# Altium project J_Tag.PrjPCB
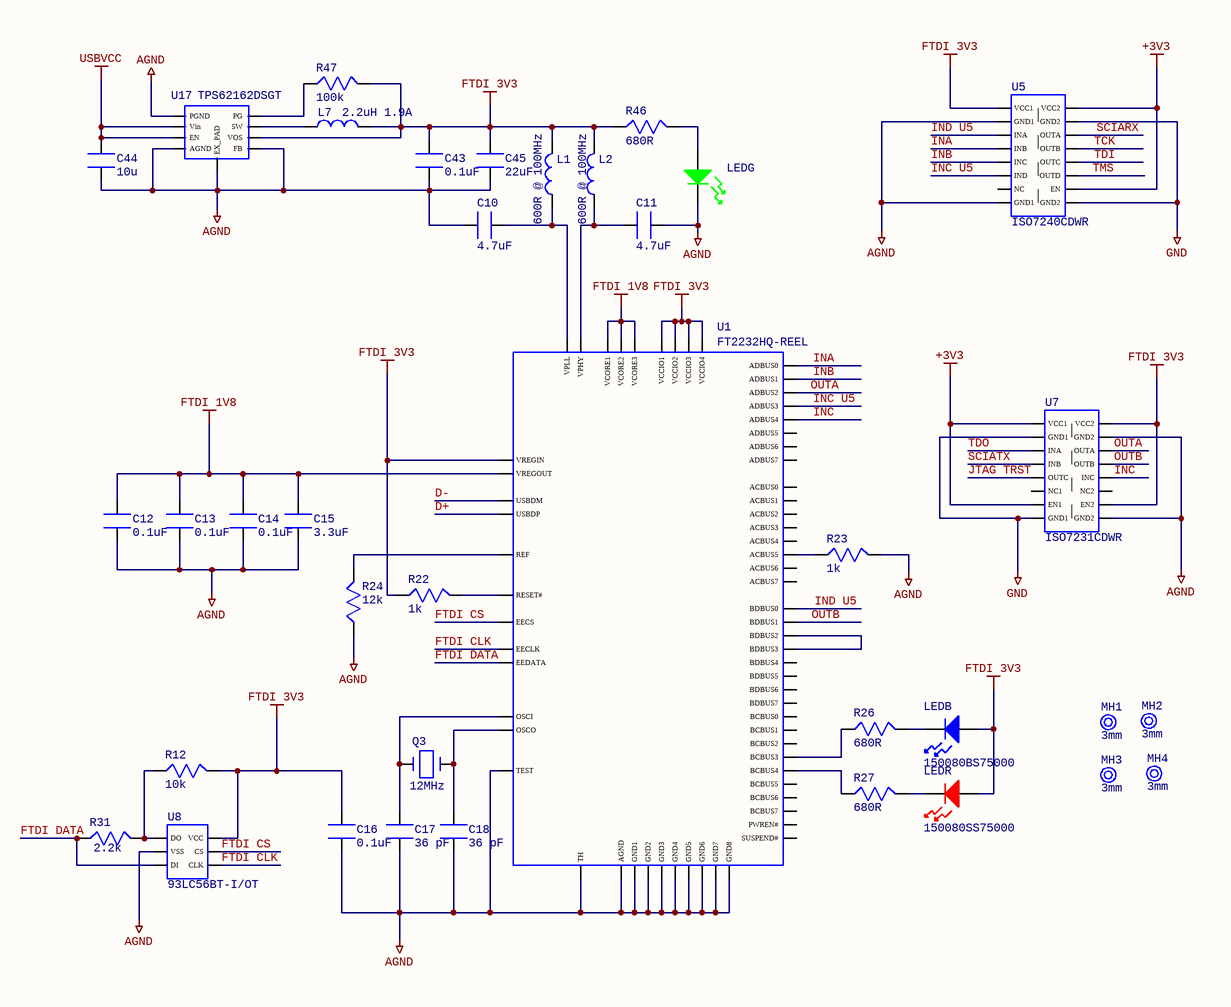
[diagram p0: J_TAG_SCH.SchDoc]
2 sheets, 46 parts. Net scope: global (net labels, ports and power ports of the same name join across sheets).
Board file: J_TAG_PCB.PcbDoc
Sheets:
  J_TAG_SCH.SchDoc
  Konektori_SCH.SchDoc

## Sheet J_TAG_SCH.SchDoc
size A3

### Parts
C10  4.7uF  [GRM155R60J475ME47D]
C11  4.7uF  [GRM155R60J475ME47D]
C12  0.1uF  [GRM155R61A104KA01D]
C13  0.1uF  [GRM155R61A104KA01D]
C14  0.1uF  [GRM155R61A104KA01D]
C15  3.3uF  [C1608X5R1C335K080AC]
C16  0.1uF  [GRM155R61A104KA01D]
C17  36 pF  [GRM1555C1H360JA01D]
C18  36 pF  [GRM1555C1H360JA01D]
C43  0.1uF  [GRM155R61A104KA01D]
C44  10u  [GRM32DR71E106KA12L]
C45  22uF  [GRM32ER61E226KE15L]
L1  600R @ 100MHz  [BLM15AG601SN1D]
L2  600R @ 100MHz  [BLM15AG601SN1D]
L7  2.2uH 1.9A  [CDRH2D18/HPNP-2R2NC]
LEDB  150080BS75000  [150080BS75000]
LEDG  (no value)  [150080VS75000]
LEDR  150080SS75000  [150080SS75000]
MH1  3mm  [MH_3MM]
MH2  3mm  [MH_3MM]
MH3  3mm  [MH_3MM]
MH4  3mm  [MH_3MM]
Q3  12MHz  [ABLS2-12.000MHZ-D4Y-T]
R12  10k  [RC0402FR-0710KL]
R22  1k  [RC0402FR-071KL]
R23  1k  [RC0402FR-071KL]
R24  12k  [RC0402FR-0712KL]
R26  680R  [RC0402FR-07680RL]
R27  680R  [RC0402FR-07680RL]
R31  2.2k  [CRCW04022K20FKEDC]
R46  680R  [RC0402FR-07680RL]
R47  100k  [RC0402FR-07100KL]
U1  FT2232HQ-REEL  [FT2232HQ-REEL]
U5  ISO7240CDWR  [ISO7240CDWR]
U7  ISO7231CDWR  [ISO7231CDWR]
U8  93LC56BT-I/OT  [93LC56BT-I/OT]
U17  TPS62162DSGT  [TPS62162DSGT]

### Nets
+3V3: U5.EN U5.VCC2 U7.EN1 U7.VCC1
AGND: C10.1 C11.2 C12.1 C13.1 C14.1 C15.1 C16.1 C17.1 C18.1 C43.1 C44.1 C45.1 LEDG.K R23.2 R24.1 U1.AGND U1.GND1 U1.GND2 U1.GND3 U1.GND4 U1.GND5 U1.GND6 U1.GND7 U1.GND8 U1.TEST U1.TH U5.GND1 U7.GND2 U8.VSS U17.AGND U17.EX_PAD U17.FB U17.PGND
FTDI 1V8: C12.2 C13.2 C14.2 C15.2 U1.VCORE1 U1.VCORE2 U1.VCORE3 U1.VREGOUT
FTDI 3V3: C16.2 C43.2 C45.2 L1.1 L2.1 L7.1 LEDB.A LEDR.A R12.2 R22.1 R46.1 R47.2 U1.VCCIO1 U1.VCCIO2 U1.VCCIO3 U1.VCCIO4 U1.VREGIN U5.VCC1 U7.EN2 U7.VCC2 U8.VCC U17.VOS
GND: U5.GND2 U7.GND1
USBVCC: C44.2 U17.EN U17.Vin
D+: U1.USBDP
D-: U1.USBDM
FTDI CLK: U1.EECLK U8.CLK
FTDI CS: U1.EECS U8.CS
FTDI DATA: R31.1 U1.EEDATA U8.DI
INA: U1.ADBUS0 U5.INB
INB: U1.ADBUS1 U5.INC
INC: U1.ADBUS4 U7.INC
INC U5: U1.ADBUS3 U5.IND
IND U5: U1.BDBUS0 U5.INA
JTAG TRST: U7.OUTC
OUTA: U1.ADBUS2 U7.OUTA
OUTB: U1.BDBUS1 U7.OUTB
SCIARX: U5.OUTA
SCIATX: U7.INB
TCK: U5.OUTB
TDI: U5.OUTC
TDO: U7.INA
TMS: U5.OUTD
NetC10_2: C10.2 L1.2 U1.VPLL
NetC11_1: C11.1 L2.2 U1.VPHY
NetC17_2: C17.2 Q3.1 U1.OSCI
NetC18_2: C18.2 Q3.2 U1.OSCO
NetL7_2: L7.2 U17.SW
NetLEDB_K: LEDB.K R26.2
NetLEDG_A: LEDG.A R46.2
NetLEDR_K: LEDR.K R27.2
NetR12_1: R12.1 R31.2 U8.DO
NetR22_2: R22.2 U1.RESET#
NetR23_1: R23.1 U1.ACBUS5
NetR24_2: R24.2 U1.REF
NetR26_1: R26.1 U1.BCBUS3
NetR27_1: R27.1 U1.BCBUS4
NetR47_1: R47.1 U17.PG
NetU1_BDBUS2: U1.BDBUS2 U1.BDBUS3

Not connected (* = marked no-connect by the designer): U1 ACBUS0 ACBUS1 ACBUS2 ACBUS3 ACBUS4 ACBUS6 ACBUS7 ADBUS5 ADBUS6 ADBUS7 BCBUS0 BCBUS1 BCBUS2 BCBUS5 BCBUS6 BCBUS7 BDBUS4 BDBUS5 BDBUS6 BDBUS7 PWREN# SUSPEND#; U5 NC; U7 NC1 NC2

### Library data of the parts
C10 C11 = GRM155R60J475ME47D: C10, C11; Supplier 1: Digi-Key; Supplier Part Number 1: 490-5915-1-ND
C12-C14 C16 C43 = GRM155R61A104KA01D: C12, C13, C14, C16, C43; Supplier 1: Digi-Key; Supplier Part Number 1: 490-1318-6-ND
C15 = C1608X5R1C335K080AC: C15; Supplier 1: Digi-Key; Supplier Part Number 1: 445-7476-6-ND
C17 C18 = GRM1555C1H360JA01D: C17, C18; Supplier 1: Digi-Key; Supplier Part Number 1: 490-6044-6-ND
C44 = GRM32DR71E106KA12L: C41, C44, 10u; Supplier 1: Digi-Key; Supplier Part Number 1: 490-1867-6-ND
C45 = GRM32ER61E226KE15L: C45; Supplier 1: Digi-Key; Supplier Part Number 1: 490-3889-6-ND
L1 L2 = BLM15AG601SN1D: L1, L2; Supplier 1: Digi-Key; Supplier Part Number 1: 490-1006-6-ND
L7 = CDRH2D18/HPNP-2R2NC: L7; Supplier 1: Digi-Key; Supplier Part Number 1: 308-2295-6-ND
LEDB = 150080BS75000onent_1: BLUE LED; Supplier 1: Digi-Key; Supplier Part Number 1: 732-4982-6-ND
LEDG = 150080VS75000: GREEN LED; Supplier 1: Digi-Key; Supplier Part Number 1: 732-4986-6-ND
LEDR = 150080SS75000: RED LED; Supplier 1: Digi-Key; Supplier Part Number 1: 732-4985-6-ND
MH1-MH4 = TH_3MM: odsojnik
Q3 = ABLS2-12.000MHZ-D4Y-T: Oscilator 12MHz; Supplier 1: Digi-Key; Supplier Part Number 1: 535-9869-6-ND
R12 = RC0402FR-0710KL: R12, 10K; Supplier 1: Digi-Key; Supplier Part Number 1: 311-10.0KLRDKR-ND
R22 R23 = RC0402FR-071KL: R22, R23, 1K; Supplier 1: Digi-Key; Supplier Part Number 1: 311-1.00KLRDKR-ND
R24 = RC0402FR-0712KL: Supplier 1: Digi-Key; Supplier Part Number 1: 311-12.0KLRDKR-ND
R26 R27 R46 = RC0402FR-07680RL: R26, R27, R46, RC0402FR-07680RL; Supplier 1: Digi-Key; Supplier Part Number 1: 311-680LRDKR-ND
R31 = CRCW04022K20FKEDC: R31; Supplier 1: Digi-Key; Supplier Part Number 1: 541-3971-6-ND
R47 = RC0402FR-07100KL: Supplier 1: Digi-Key; Supplier Part Number 1: 311-100KLRDKR-ND
U1 = FT2232HQ-REEL: IC kontroler; Supplier 1: Digi-Key; Supplier Part Number 1: 768-1025-6-ND
U5 = ISO7240CDWR: Izolator; Supplier 1: Digi-Key; Supplier Part Number 1: 296-38555-6-ND
U7 = ISO7231CDWR: Izolator; Supplier 1: Digi-Key; Supplier Part Number 1: 296-38966-6-ND
U8 = 93LC56BT-I/OT: IC memorija; Supplier 1: Digi-Key; Supplier Part Number 1: 93LC56BT-I/OTDKR-ND
U17 = TPS62162DSGT: DC-DC Buck; Supplier 1: Digi-Key; Supplier Part Number 1: 296-29897-1-ND

## Sheet Konektori_SCH.SchDoc: J_Tag_Programator
size A; CheckedBy: Lazar Nikolovski; Author: Lazar Nikolovski; CompanyName: Herran Innovation Ltd.; DrawnBy: Lazar Nikolovski; Engineer: Lazar Nikolovski; DocumentNumber: 2
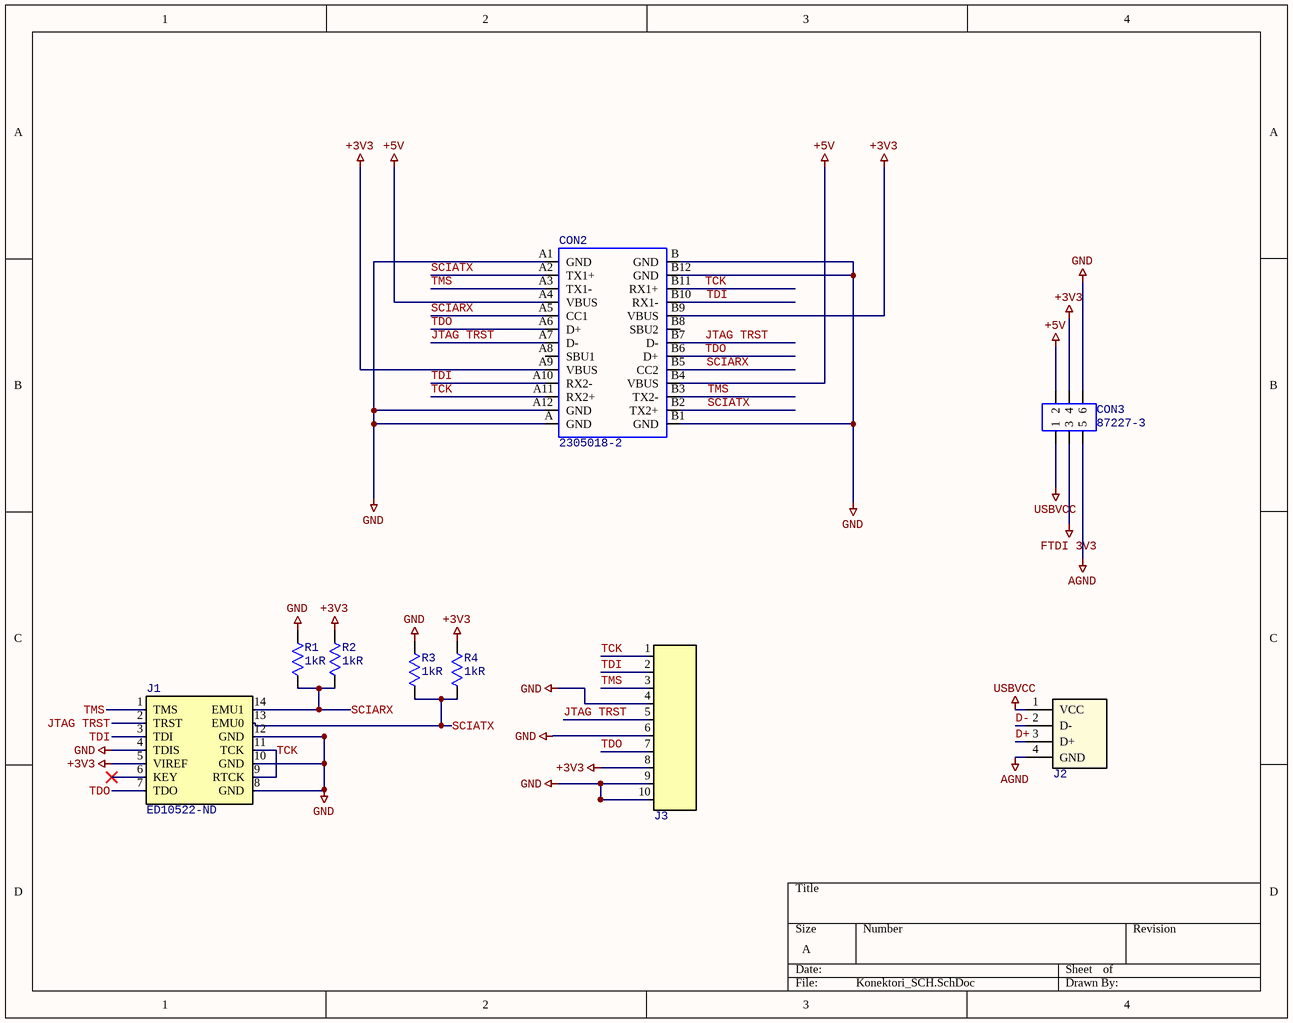
[diagram p1: Konektori_SCH.SchDoc]

### Parts
CON2  2305018-2  [2305018-2]
CON3  87227-3  [87227-3]
J1  ED10522-ND  [14_DIP_JTAG]
J2  USB-B1HSB6  [CON_RCPT_USB-B1HSB6]  (value not drawn)
J3  8-215079-0  [CON_BTB_F_8-215079-0]  (value not drawn)
R1  Resistance: 1kR  [SMD_0603_RES]  (hidden comment: RC0603FR-071KL)
R2  Resistance: 1kR  [SMD_0603_RES]  (hidden comment: RC0603FR-071KL)
R3  Resistance: 1kR  [SMD_0603_RES]  (hidden comment: RC0603FR-071KL)
R4  Resistance: 1kR  [SMD_0603_RES]  (hidden comment: RC0603FR-071KL)

### Nets
+3V3: CON2.A9(VBUS) CON2.B9(VBUS) CON3.4 J1.5(VIREF) J3.8 R2.2 R4.2
+5V: CON2.A4(VBUS) CON2.B4(VBUS) CON3.2
AGND: CON3.5 J2.4(GND)
FTDI 3V3: CON3.3
GND: CON2.A(GND) CON2.A1(GND) CON2.A12(GND) CON2.B(GND) CON2.B1(GND) CON2.B12(GND) CON3.6 J1.4(TDIS) J1.8(GND) J1.10(GND) J1.12(GND) J3.4 J3.6 J3.9 J3.10 R1.2 R3.2
USBVCC: CON3.1 J2.1(VCC)
D+: J2.3(D+)
D-: J2.2(D-)
JTAG TRST: CON2.A7(D-) CON2.B7(D-) J1.2(TRST) J3.5
SCIARX: CON2.A5(CC1) CON2.B5(CC2) J1.14(EMU1) R1.1 R2.1
SCIATX: CON2.A2(TX1+) CON2.B2(TX2+) J1.13(EMU0) R3.1 R4.1
TCK: CON2.A11(RX2+) CON2.B11(RX1+) J1.9(RTCK) J1.11(TCK) J3.1
TDI: CON2.A10(RX2-) CON2.B10(RX1-) J1.3(TDI) J3.2
TDO: CON2.A6(D+) CON2.B6(D+) J1.7(TDO) J3.7
TMS: CON2.A3(TX1-) CON2.B3(TX2-) J1.1(TMS) J3.3

Not connected (* = marked no-connect by the designer): CON2 A8(SBU1) B8(SBU2); J1 6(KEY)*

### Library data of the parts
CON2 = 2305018-2: USB C konektor; Supplier 1: Digi-Key; Supplier Part Number 1: A132569DKR-ND
CON3 = 87227-3: Heder, 3x2, M; Supplier 1: Digi-Key; Supplier Part Number 1: A26569-ND
J1 = CONN_JTAG_Boxheader 14-pol: CONN HEADER VERT 14POS 2.54MM; Manufacturer: On-Shore Technology; Manufacturer Part Number: 302-S141; Connector Type: Male Pin; Number of Positions: 14; Pitch: 0.1inch; Supplier 1: Digi-Key; RoHS: Yes; Category: Connectors; Stock 1: 34434; Pricing 1: 1=0,32000, 10=0,27400, 200=0,21280, 600=0,18240, 1000=0,15200, 5000=0,13029, 10000=0,12160 (USD); Mount: Through Hole; Color: Black; Contact Plating: Gold; Number of Rows: 2; Packaging: Tray; Termination: Solder; Row Spacing: 0.1inch; ComponentLink1URL: https://datasheet.ciiva.com/742/302-sxxx-742188.pdf?src-supplier=Digi-Key; ComponentLink1Description: https://datasheet.ciiva.com/742/302-sxxx-742188.pdf?src-supplier=Digi-Key; Supplier Part Number 1: ED10522-ND
J2 = CON_RCTB_USB-B1HSB6: CONN RCPT TYPEB 4POS R/A; Manufacturer: On-Shore Technology; Connector Type: USB; Number of Contacts: 4; Gender: Receptacle; Supplier 1: Digi-Key; Manufacturer Part Number: USB-B1HSB6; RoHS: Yes; Category: Connectors; Stock 1: 7174; Pricing 1: 1=0,61000, 10=0,53300, 25=0,48720, 40=0,45875, 117=0,43957, 234=0,40132, 468=0,38220, 1053=0,31532, 2457=0,28665 (USD); Mount: Through Hole,Horizontal; Package Quantity: 50; Packaging: Tray; ComponentLink1URL: https://datasheet.ciiva.com/851/usb-b1hsxx-851167.pdf?src-supplier=Digi-Key; ComponentLink1Description: https://datasheet.ciiva.com/851/usb-b1hsxx-851167.pdf?src-supplier=Digi-Key; Supplier Part Number 1: ED2983-ND
J3 = CON_BTB_F_8-215079-0: CONN FMALE-ON-BRD 10POS VERT T/H; Manufacturer: TE Connectivity; Contact Resistance: 10mR; Connector Type: Receptacle,Connector,Pin; Number of Positions: 10; Insulation Resistance: 1GR; Board Standoff: No (Without); Connector System: Board-to-Board; PCB Mount Retention: With; PCB Mounting Orientation: Vertical; Shrouded: Yes (With); Contact Current Rating: 1.5A; Gender: Receptacle; Voltage Rating: 230V; Working Voltage: 100V; Pitch: 0.05inch; Row Spacing: 0.1inch; Plating Thickness: 0.005um; Contact Post Length: 0.122inch; Supplier 1: Digi-Key; Manufacturer Part Number: 8-215079-0; RoHS: Yes; Category: Headers and Wire Housings; Stock 1: 3227; Pricing 1: 1=1.51000, 10=1.37400, 100=1.17800 (USD); Mount: Through Hole; Number of Pins: 10; Contact Plating: Tin; Contact Material: Bronze; Color: Red; Housing Color: Red; Housing Material: Polyester; Insulation Material: PBT; Insulation Color: Red; Min Operating Temperature: -40°C; Max Operating Temperature: 105°C; Number of Rows: 2; Packaging: Box; Package Quantity: 250; Termination: Through Hole; Number of Contacts: 10; Orientation: Straight; Mating Alignment: No (Without); Mating Retention: No (Without); PCB Mount Alignment: No (Without); Current Rating: 1.5A; Fastening Type: Push,Pull; Voltage Rating (DC): 100V; Length: 14.7mm; Width: 14.7mm; Height: 0.16inch; Depth: 5.1mm; Radiation Hardening: No; ELV: Compliant; Flammability Rating: UL94 V-0; REACH SVHC: No SVHC; ComponentLink1URL: https://datasheet.ciiva.com/11745/0900766b8101108b-11745837.pdf?src-supplier=RSComponents; ComponentLink1Description: https://datasheet.ciiva.com/11745/0900766b8101108b-11745837.pdf?src-supplier=RSComponents; ComponentLink2URL: https://datasheet.ciiva.com/5723/493968-5723952.pdf?src-supplier=Farnell; ComponentLink2Description: https://datasheet.ciiva.com/5723/493968-5723952.pdf?src-supplier=Farnell; ComponentLink3URL: https://datasheet.ciiva.com/25908/eng-cs-82012-ribbon-cable-interconnect-sol-0412-25908056.pdf?src-supplier=Avnet+Europe; ComponentLink3Description: https://datasheet.ciiva.com/25908/eng-cs-82012-ribbon-cable-interconnect-sol-0412-25908056.pdf?src-supplier=Avnet+Europe; ComponentLink4URL: https://datasheet.ciiva.com/30057/eng-cat-889409-0699-96-30057720.pdf?src-supplier=Onlinecomponents.com; ComponentLink4Description: https://datasheet.ciiva.com/30057/eng-cat-889409-0699-96-30057720.pdf?src-supplier=Onlinecomponents.com; ComponentLink5URL: https://datasheet.ciiva.com/754/eng-cd-215079-y-754233.pdf?src-supplier=Digi-Key; ComponentLink5Description: https://datasheet.ciiva.com/754/eng-cd-215079-y-754233.pdf?src-supplier=Digi-Key; ComponentLink6URL: https://datasheet.ciiva.com/14156/mo215079-128482-90-dat-en-14156698.pdf?src-supplier=Distrelec; ComponentLink6Description: https://datasheet.ciiva.com/14156/mo215079-128482-90-dat-en-14156698.pdf?src-supplier=Distrelec; ComponentLink7URL: https://datasheet.ciiva.com/754/eng-cd-215079-y-754187.pdf?src-supplier=Digi-Key; ComponentLink7Description: https://datasheet.ciiva.com/754/eng-cd-215079-y-754187.pdf?src-supplier=Digi-Key; ComponentLink8URL: https://datasheet.ciiva.com/43491/747833-da-01-en-federleiste-gerade-10pol-43491941.pdf?src-supplier=Conrad; ComponentLink8Description: https://datasheet.ciiva.com/43491/747833-da-01-en-federleiste-gerade-10pol-43491941.pdf?src-supplier=Conrad; Supplier Part Number 1: A99470CT-ND
R1-R4 = RES_0603_1K_1%_1/10W: RES SMD 1K OHM 1% 1/10W 0603; Manufacturer: Yageo; Temperature Coefficient: 100ppm/°C; Power Rating: 100mW; Voltage Rating: 50V; Supplier 1: Digi-Key; Manufacturer Part Number: RC0603FR-071KL; RoHS: Yes; Category: Chip SMD Resistors; Stock 1: 24609199; Pricing 1: 1=0.10000, 10=0.02300, 100=0.00930, 1000=0.00417, 2500=0.00362 (USD); Case/Package: 0603; Contact Plating: Tin,Matte; Case Code (Imperial): 0603; Case Code (Metric): 1608; Size Code: 0603; Min Operating Temperature: -55°C; Max Operating Temperature: 155°C; Tolerance: 1%; Packaging: Tape and Reel; Resistor Type: Thick Film; Termination: SMD/SMT; Features: Moisture Resistant; Series: RC; Max Power Dissipation: 100mW; Number of Terminations: 2; Resistance Tolerance: 1%; Construction: Rectangular; Technology: THICK FILM; Length: 1.6mm; Height: 0.45mm; Depth: 0.8mm; Radiation Hardening: No; REACH SVHC: No SVHC; Lead Free: Lead Free; Military Standard: Not; RoHS Compliant: Yes; ComponentLink1URL: https://datasheet.ciiva.com/11808/0900766b80f96399-11808081.pdf?src-supplier=RSComponents; ComponentLink1Description: https://datasheet.ciiva.com/11808/0900766b80f96399-11808081.pdf?src-supplier=RSComponents; ComponentLink2URL: https://datasheet.ciiva.com/25906/pyu-rc0603-51-rohs-l-4-25906933.pdf?src-supplier=Avnet+Europe; ComponentLink2Description: https://datasheet.ciiva.com/25906/pyu-rc0603-51-rohs-l-4-25906933.pdf?src-supplier=Avnet+Europe; ComponentLink3URL: https://datasheet.ciiva.com/7660/1868787-7660790.pdf?src-supplier=Element14; ComponentLink3Description: https://datasheet.ciiva.com/7660/1868787-7660790.pdf?src-supplier=Element14; ComponentLink4URL: https://datasheet.ciiva.com/7746/1738695-7746279.pdf?src-supplier=Element14; ComponentLink4Description: https://datasheet.ciiva.com/7746/1738695-7746279.pdf?src-supplier=Element14; ComponentLink5URL: https://datasheet.ciiva.com/7746/1686128-7746280.pdf?src-supplier=Element14; ComponentLink5Description: https://datasheet.ciiva.com/7746/1686128-7746280.pdf?src-supplier=Element14; ComponentLink6URL: https://datasheet.ciiva.com/28386/pyu-rc0603-51-rohs-l-4-28386648.pdf?src-supplier=Avnet+Europe; ComponentLink6Description: https://datasheet.ciiva.com/28386/pyu-rc0603-51-rohs-l-4-28386648.pdf?src-supplier=Avnet+Europe; ComponentLink7URL: https://datasheet.ciiva.com/7746/1738695-7746281.pdf?src-supplier=Element14; ComponentLink7Description: https://datasheet.ciiva.com/7746/1738695-7746281.pdf?src-supplier=Element14; ComponentLink8URL: https://datasheet.ciiva.com/8896/pyu-rc0603-51-rohs-l-4-8896106.pdf?src-supplier=Avnet; ComponentLink8Description: https://datasheet.ciiva.com/8896/pyu-rc0603-51-rohs-l-4-8896106.pdf?src-supplier=Avnet; ComponentLink9URL: https://datasheet.ciiva.com/15189/getdatasheetpartid-404327-15189644.pdf?src-supplier=Verical; ComponentLink9Description: https://datasheet.ciiva.com/15189/getdatasheetpartid-404327-15189644.pdf?src-supplier=Verical; ComponentLink10URL: https://datasheet.ciiva.com/7983/443971-7983613.pdf?src-supplier=Element14; ComponentLink10Description: https://datasheet.ciiva.com/7983/443971-7983613.pdf?src-supplier=Element14; Supplier Part Number 1: 311-1.00KHRCT-ND

## Nets that join several sheets
+3V3: J_TAG_SCH (U5.EN U5.VCC2 U7.EN1 U7.VCC1), Konektori_SCH (7 pins)
AGND: J_TAG_SCH (33 pins), Konektori_SCH (CON3.5 J2.4)
FTDI 3V3: J_TAG_SCH (22 pins), Konektori_SCH (CON3.3)
GND: J_TAG_SCH (U5.GND2 U7.GND1), Konektori_SCH (17 pins)
USBVCC: J_TAG_SCH (C44.2 U17.EN U17.Vin), Konektori_SCH (CON3.1 J2.1)
D+: J_TAG_SCH (U1.USBDP), Konektori_SCH (J2.3)
D-: J_TAG_SCH (U1.USBDM), Konektori_SCH (J2.2)
JTAG TRST: J_TAG_SCH (U7.OUTC), Konektori_SCH (CON2.A7 CON2.B7 J1.2 J3.5)
SCIARX: J_TAG_SCH (U5.OUTA), Konektori_SCH (5 pins)
SCIATX: J_TAG_SCH (U7.INB), Konektori_SCH (5 pins)
TCK: J_TAG_SCH (U5.OUTB), Konektori_SCH (5 pins)
TDI: J_TAG_SCH (U5.OUTC), Konektori_SCH (CON2.A10 CON2.B10 J1.3 J3.2)
TDO: J_TAG_SCH (U7.INA), Konektori_SCH (CON2.A6 CON2.B6 J1.7 J3.7)
TMS: J_TAG_SCH (U5.OUTD), Konektori_SCH (CON2.A3 CON2.B3 J1.1 J3.3)